# Altium project DDS.PrjPcb
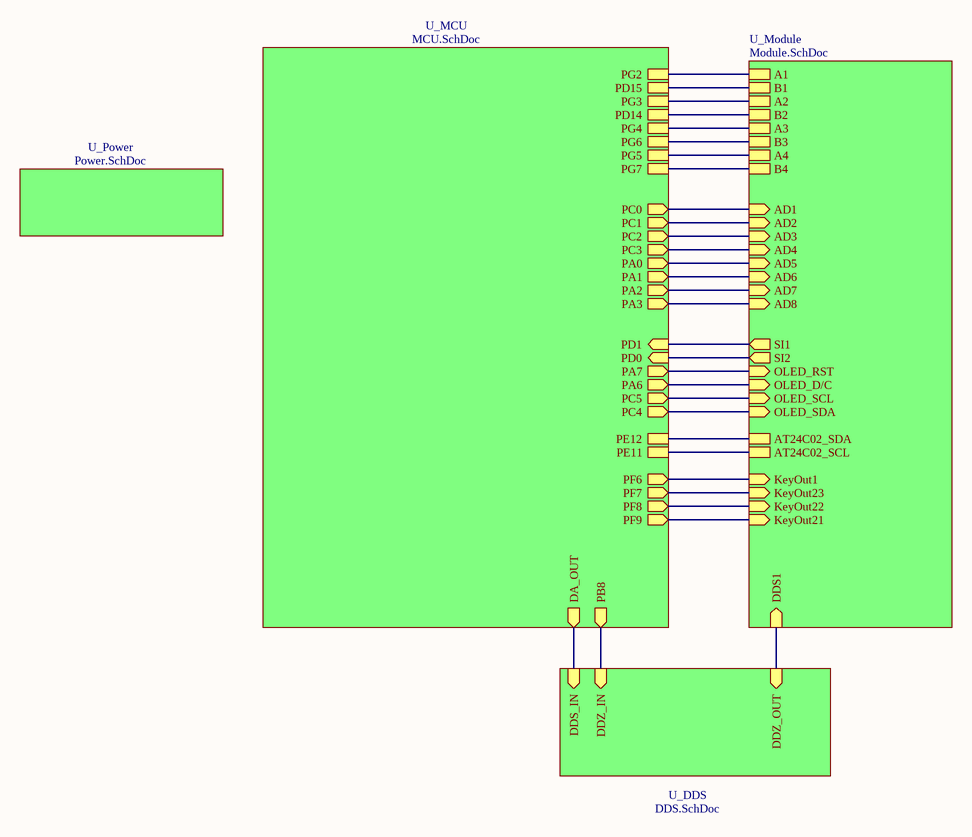
[diagram p0: TOP.SchDoc]
5 sheets, 127 parts. Net scope: hierarchical (ports join the sheet entries above them; power ports are global).
Board file: DDS.PcbDoc
Sheets:
  TOP.SchDoc
    U_Power = Power.SchDoc
    U_Module = Module.SchDoc
    U_MCU = MCU.SchDoc
    U_DDS = DDS.SchDoc

## Sheet TOP.SchDoc
size A4

### Sub-sheets
U_DDS = DDS.SchDoc: DDS_IN (in), DDZ_OUT (in), DDZ_IN (in)
U_MCU = MCU.SchDoc: PG3, PG4, PG2, PG5, PD15, PD14, PG6, PG7, PA2 (out), PA3 (out), PA7 (out), PA6 (out), PC4 (out), PC5 (out), PA0 (out), PA1 (out), PD1 (in), PB8 (out), DA_OUT (out), PC3 (out), PC2 (out), PC1 (out), PC0 (out), PE12, PE11, PD0 (in), PF6 (out), PF7 (out), PF8 (out), PF9 (out)
U_Module = Module.SchDoc: AT24C02_SCL, AT24C02_SDA, A1, B1, OLED_D/C (in), OLED_RST (in), OLED_SDA (in), OLED_SCL (in), DDS1 (in), A2, B2, A3, B3, A4, B4, SI1 (out), AD1 (in), AD2 (in), AD3 (in), AD4 (in), AD5 (in), AD6 (in), AD7 (in), AD8 (in), SI2 (out), KeyOut1 (in), KeyOut21 (in), KeyOut22 (in), KeyOut23 (in)
U_Power = Power.SchDoc: no entries

### Nets
A1: sheet U_Module/A1, sheet U_MCU/PG2
A2: sheet U_Module/A2, sheet U_MCU/PG3
A3: sheet U_Module/A3, sheet U_MCU/PG4
A4: sheet U_Module/A4, sheet U_MCU/PG5
B1: sheet U_Module/B1, sheet U_MCU/PD15
B2: sheet U_Module/B2, sheet U_MCU/PD14
B3: sheet U_Module/B3, sheet U_MCU/PG6
B4: sheet U_Module/B4, sheet U_MCU/PG7
NetC41_2: sheet U_Module/SI2, sheet U_MCU/PD0
NetC46_2: sheet U_Module/SI1, sheet U_MCU/PD1
NetJ1_20: sheet U_Module/DDS1, sheet U_DDS/DDZ_OUT
NetR8_2: sheet U_MCU/PB8, sheet U_DDS/DDZ_IN
NetR21_2: sheet U_Module/AT24C02_SCL, sheet U_MCU/PE11
NetR24_2: sheet U_Module/AT24C02_SDA, sheet U_MCU/PE12
NetR45_1: sheet U_MCU/DA_OUT, sheet U_DDS/DDS_IN
NetU3_18: sheet U_Module/KeyOut1, sheet U_MCU/PF6
NetU3_19: sheet U_Module/KeyOut23, sheet U_MCU/PF7
NetU3_20: sheet U_Module/KeyOut22, sheet U_MCU/PF8
NetU3_21: sheet U_Module/KeyOut21, sheet U_MCU/PF9
NetU3_26: sheet U_Module/AD1, sheet U_MCU/PC0
NetU3_27: sheet U_Module/AD2, sheet U_MCU/PC1
NetU3_28: sheet U_Module/AD3, sheet U_MCU/PC2
NetU3_29: sheet U_Module/AD4, sheet U_MCU/PC3
NetU3_34: sheet U_Module/AD5, sheet U_MCU/PA0
NetU3_35: sheet U_Module/AD6, sheet U_MCU/PA1
NetU3_36: sheet U_Module/AD7, sheet U_MCU/PA2
NetU3_37: sheet U_Module/AD8, sheet U_MCU/PA3
NetU3_42: sheet U_Module/OLED_D/C, sheet U_MCU/PA6
NetU3_43: sheet U_Module/OLED_RST, sheet U_MCU/PA7
NetU3_44: sheet U_Module/OLED_SDA, sheet U_MCU/PC4
NetU3_45: sheet U_Module/OLED_SCL, sheet U_MCU/PC5

## Sheet Power.SchDoc
size A4
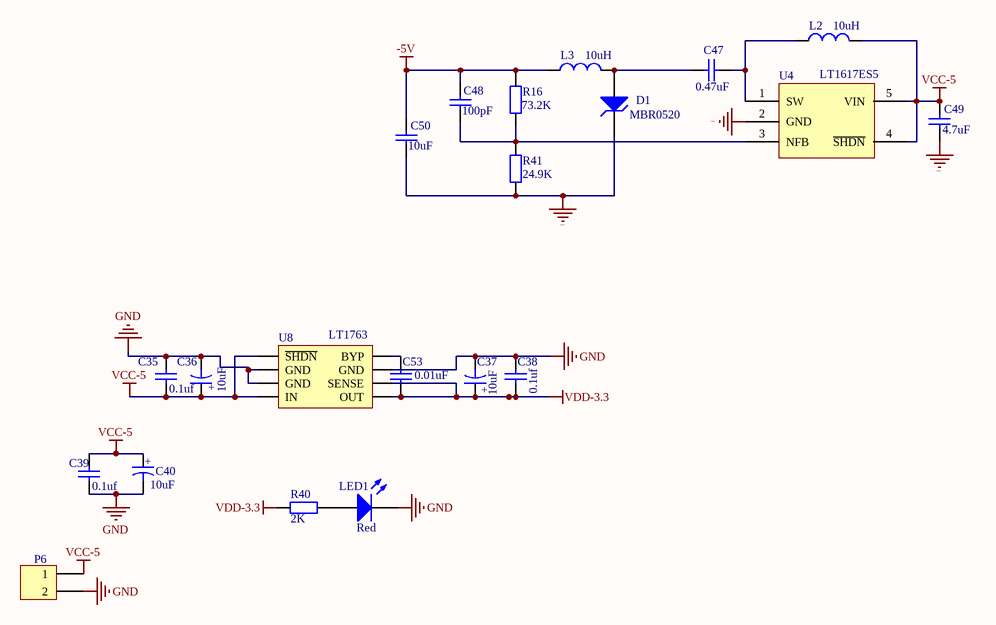
[diagram p1: Power.SchDoc]

### Parts
C35  value 0.1uf  [0805]  (hidden comment: Capacitor-0805)
C36  value 10uF  [钽电容1206（A3216）]  (hidden comment: 电解电容)
C37  value 10uF  [钽电容1206（A3216）]  (hidden comment: 电解电容)
C38  value 0.1uf  [0805]  (hidden comment: Capacitor-0805)
C39  value 0.1uf  [0805]  (hidden comment: Capacitor-0805)
C40  value 10uF  [钽电容1206（A3216）]  (hidden comment: 电解电容)
C47  value 0.47uF  [0805]  (hidden comment: Capacitor-0805)
C48  value 100pF  [0603]  (hidden comment: Capacitor-0603)
C49  value 4.7uF  [0805]  (hidden comment: Capacitor-0805)
C50  value 10uF  [0805]  (hidden comment: Capacitor-0805)
C53  value 0.01uF  [0603]  (hidden comment: Capacitor-0805)
D1  Name: MBR0520  [SMBJ20A]  (hidden comment: SMBJ20A)
L2  value 10uH  [0805]  (hidden comment: Inductor)
L3  value 10uH  [0805]  (hidden comment: Inductor)
LED1  Color: Red  [LED-0805]  (hidden comment: LED)
P6  端子  [2MM接线端子]  (value not drawn)
R16  value 73.2K  [0603]  (hidden comment: Resistor-0603)
R40  value 2K  [0603]  (hidden comment: Resistor-0603)
R41  value 24.9K  [0603]  (hidden comment: Resistor-0603)
U4  LT1617ES5  [SOT23-5]
U8  LT1763  [LT1963]

### Nets
-5V: C48.2 C50.2 L3.1 R16.2
GND: C35.2 C36.1 C37.1 C38.2 C39.1 C40.1 C49.1 C50.1 D1.2(K) LED1.2 P6.2 R41.1 U4.2(GND) U8.3(GND) U8.6(GND) U8.7(GND)
VCC-5: C35.1 C36.2 C39.2 C40.2 C49.2 L2.2 P6.1 U4.4(~{SHDN}) U4.5(VIN) U8.5(~{SHDN}) U8.8(IN)
VDD-3.3: C37.2 C38.1 C53.1 R40.2 U8.1(OUT) U8.2(SENSE)
NetC47_1: C47.1 L2.1 U4.1(SW)
NetC47_2: C47.2 D1.1(A) L3.2
NetC48_1: C48.1 R16.1 R41.2 U4.3(NFB)
NetC53_2: C53.2 U8.4(BYP)
NetLED1_1: LED1.1(A) R40.1

### Notes on the sheet
- (in symbol 电解电容) +
- (in symbol L) LT1963-3.3

### Library data of the parts
C35 C38 C39 C47 C49 C50 C53 = Capacitor
LED1 = LED: Value: LED
U4 = LT1617ES5: Value: LT1617ES5
U8 = LT1763: Value: LT1763

## Sheet Module.SchDoc
size A4
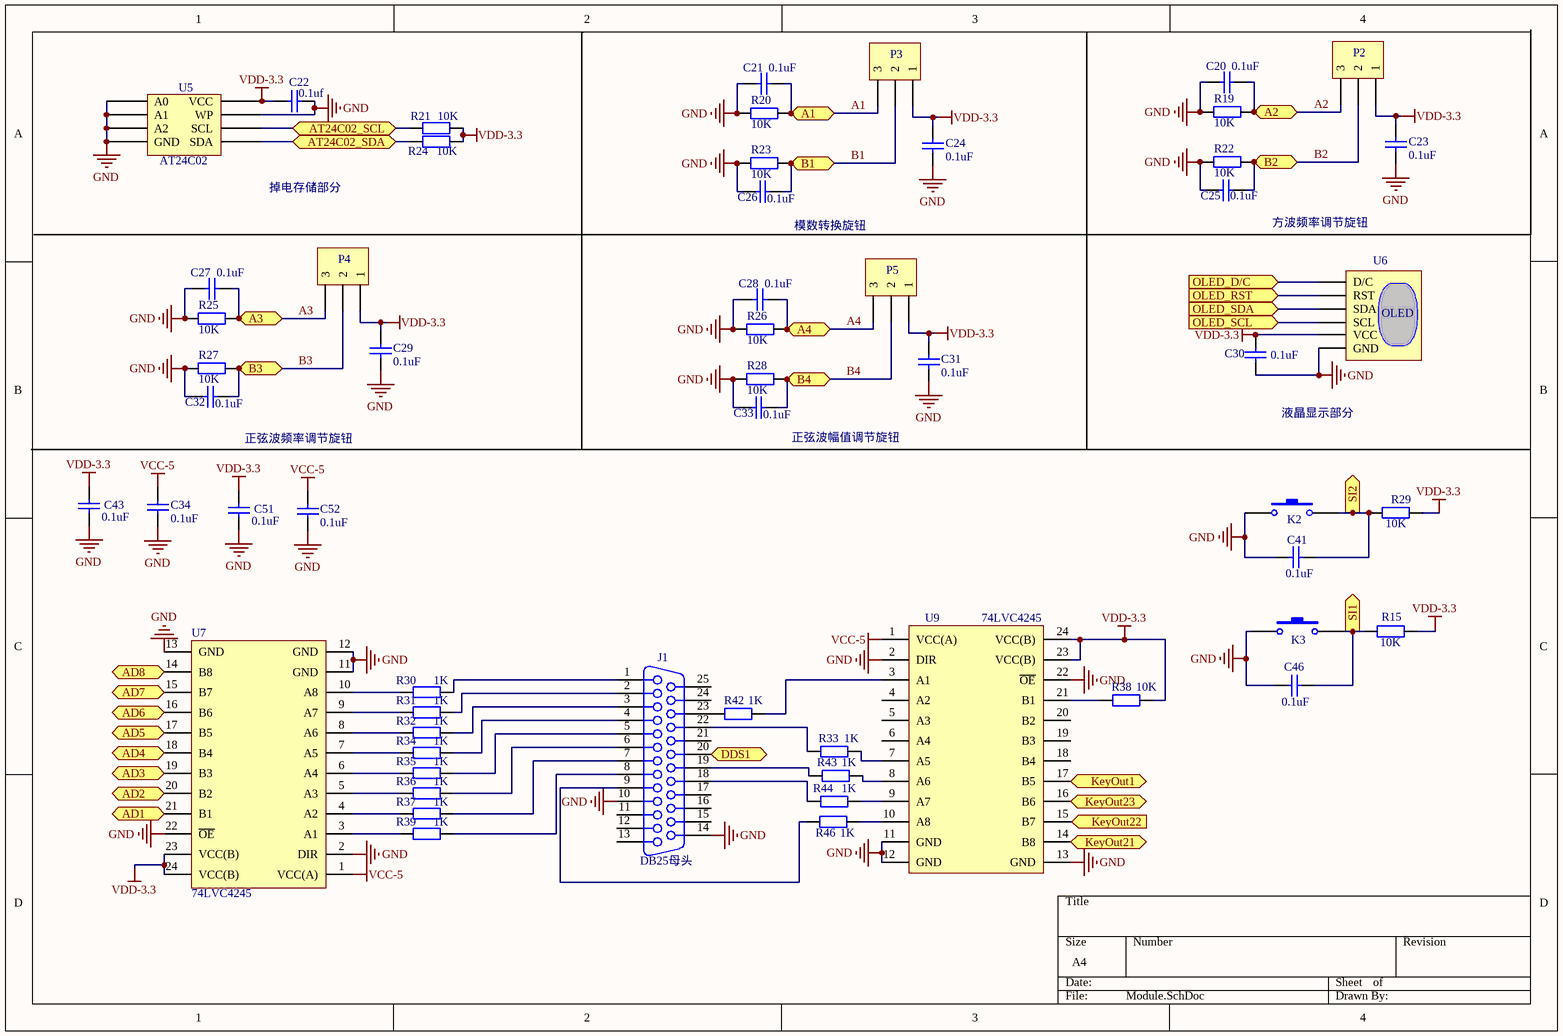
[diagram p2: Module.SchDoc]

### Parts
C20  value 0.1uF  [0603]  (hidden comment: Capacitor-0603)
C21  value 0.1uF  [0603]  (hidden comment: Capacitor-0603)
C22  value 0.1uf  [0603]  (hidden comment: Capacitor-0603)
C23  value 0.1uF  [0603]  (hidden comment: Capacitor-0603)
C24  value 0.1uF  [0603]  (hidden comment: Capacitor-0603)
C25  value 0.1uF  [0603]  (hidden comment: Capacitor-0603)
C26  value 0.1uF  [0603]  (hidden comment: Capacitor-0603)
C27  value 0.1uF  [0603]  (hidden comment: Capacitor-0603)
C28  value 0.1uF  [0603]  (hidden comment: Capacitor-0603)
C29  value 0.1uF  [0603]  (hidden comment: Capacitor-0603)
C30  value 0.1uF  [0603]  (hidden comment: Capacitor-0805)
C31  value 0.1uF  [0603]  (hidden comment: Capacitor-0603)
C32  value 0.1uF  [0603]  (hidden comment: Capacitor-0603)
C33  value 0.1uF  [0603]  (hidden comment: Capacitor-0603)
C34  value 0.1uF  [0603]  (hidden comment: Capacitor-0603)
C41  value 0.1uF  [0603]  (hidden comment: Capacitor-0603)
C43  value 0.1uF  [0603]  (hidden comment: Capacitor-0603)
C46  value 0.1uF  [0603]  (hidden comment: Capacitor-0603)
C51  value 0.1uF  [0603]  (hidden comment: Capacitor-0603)
C52  value 0.1uF  [0603]  (hidden comment: Capacitor-0603)
J1  value DB25母头  [DB25母头]  (hidden comment: DB25)
K2  按键  [2MM接线端子]  (value not drawn)
K3  按键  [2MM接线端子]  (value not drawn)
P2  端子3  [3MM接线端子]  (value not drawn)
P3  端子3  [3MM接线端子]  (value not drawn)
P4  端子3  [3MM接线端子]  (value not drawn)
P5  端子3  [3MM接线端子]  (value not drawn)
R15  value 10K  [0603]  (hidden comment: Resistor-0603)
R19  value 10K  [0603]  (hidden comment: Resistor-0603)
R20  value 10K  [0603]  (hidden comment: Resistor-0603)
R21  value 10K  [0603]  (hidden comment: Resistor-0603)
R22  value 10K  [0603]  (hidden comment: Resistor-0603)
R23  value 10K  [0603]  (hidden comment: Resistor-0603)
R24  value 10K  [0603]  (hidden comment: Resistor-0603)
R25  value 10K  [0603]  (hidden comment: Resistor-0603)
R26  value 10K  [0603]  (hidden comment: Resistor-0603)
R27  value 10K  [0603]  (hidden comment: Resistor-0603)
R28  value 10K  [0603]  (hidden comment: Resistor-0603)
R29  value 10K  [0603]  (hidden comment: Resistor-0603)
R30  value 1K  [0603]  (hidden comment: Resistor-0603)
R31  value 1K  [0603]  (hidden comment: Resistor-0603)
R32  value 1K  [0603]  (hidden comment: Resistor-0603)
R33  value 1K  [0603]  (hidden comment: Resistor-0603)
R34  value 1K  [0603]  (hidden comment: Resistor-0603)
R35  value 1K  [0603]  (hidden comment: Resistor-0603)
R36  value 1K  [0603]  (hidden comment: Resistor-0603)
R37  value 1K  [0603]  (hidden comment: Resistor-0603)
R38  value 10K  [0603]  (hidden comment: Resistor-0603)
R39  value 1K  [0603]  (hidden comment: Resistor-0603)
R42  value 1K  [0603]  (hidden comment: Resistor-0603)
R43  value 1K  [0603]  (hidden comment: Resistor-0603)
R44  value 1K  [0603]  (hidden comment: Resistor-0603)
R46  value 1K  [0603]  (hidden comment: Resistor-0603)
U5  AT24C02  [AT24C02]
U6  OLED  [OLED]
U7  74LVC4245  [74LVC4245-PW]
U9  74LVC4245  [74LVC4245-PW]

### Ports
A1, A2, A3, A4, AD1 (in), AD2 (in), AD3 (in), AD4 (in), AD5 (in), AD6 (in), AD7 (in), AD8 (in), AT24C02_SCL, AT24C02_SDA, B1, B2, B3, B4, DDS1 (in), KeyOut1 (in), KeyOut21 (in), KeyOut22 (in), KeyOut23 (in), OLED_D/C (in), OLED_RST (in), OLED_SCL (in), OLED_SDA (in), SI1 (out), SI2 (out)

### Nets
GND: C20.1 C21.1 C22.1 C23.2 C24.2 C25.1 C26.1 C27.1 C28.1 C29.2 C30.1 C31.2 C32.1 C33.1 C34.2 C41.1 C43.2 C46.1 C51.2 C52.2 J1.10 J1.14 K2.1 K3.1 R19.1 R20.1 R22.1 R23.1 R25.1 R26.1 R27.1 R28.1 U5.1(A0) U5.2(A1) U5.3(A2) U5.4(GND) U5.7(WP) U6.1(GND) U7.2(DIR) U7.11(GND) U7.12(GND) U7.13(GND) U7.22(~{OE}) U9.2(DIR) U9.11(GND) U9.12(GND) U9.13(GND) U9.22(~{OE})
VCC-5: C34.1 C52.1 U7.1(VCC(A)) U9.1(VCC(A))
VDD-3.3: C22.2 C23.1 C24.1 C29.1 C30.2 C31.1 C43.1 C51.1 P2.1 P3.1 P4.1 P5.1 R15.1 R21.1 R24.1 R29.2 R38.2 U5.8(VCC) U6.2(VCC) U7.23(VCC(B)) U7.24(VCC(B)) U9.23(VCC(B)) U9.24(VCC(B))
A1: C21.2 P3.3 R20.2 ; port A1
A2: C20.2 P2.3 R19.2 ; port A2
A3: C27.2 P4.3 R25.2 ; port A3
A4: C28.2 P5.3 R26.2 ; port A4
B1: C26.2 P3.2 R23.2 ; port B1
B2: C25.2 P2.2 R22.2 ; port B2
B3: C32.2 P4.2 R27.2 ; port B3
B4: C33.2 P5.2 R28.2 ; port B4
NetC41_2: C41.2 K2.2 R29.1 ; port SI2
NetC46_2: C46.2 K3.2 R15.2 ; port SI1
NetJ1_1: J1.1 R30.2
NetJ1_2: J1.2 R31.2
NetJ1_3: J1.3 R32.2
NetJ1_4: J1.4 R34.2
NetJ1_5: J1.5 R35.2
NetJ1_6: J1.6 R36.2
NetJ1_7: J1.7 R37.2
NetJ1_8: J1.8 R39.2
NetJ1_9: J1.9 R46.1
NetJ1_18: J1.18 R44.1
NetJ1_19: J1.19 R43.1
NetJ1_20: J1.20 ; port DDS1
NetJ1_22: J1.22 R33.1
NetJ1_23: J1.23 R42.1
NetR21_2: R21.2 U5.6(SCL) ; port AT24C02_SCL
NetR24_2: R24.2 U5.5(SDA) ; port AT24C02_SDA
NetR30_1: R30.1 U7.10(A8)
NetR31_1: R31.1 U7.9(A7)
NetR32_1: R32.1 U7.8(A6)
NetR33_2: R33.2 U9.7(A5)
NetR34_1: R34.1 U7.7(A5)
NetR35_1: R35.1 U7.6(A4)
NetR36_1: R36.1 U7.5(A3)
NetR37_1: R37.1 U7.4(A2)
NetR38_1: R38.1 U9.21(B1)
NetR39_1: R39.1 U7.3(A1)
NetR42_2: R42.2 U9.3(A1)
NetR43_2: R43.2 U9.8(A6)
NetR44_2: R44.2 U9.9(A7)
NetR46_2: R46.2 U9.10(A8)
NetU3_18: U9.17(B5) ; port KeyOut1
NetU3_19: U9.16(B6) ; port KeyOut23
NetU3_20: U9.15(B7) ; port KeyOut22
NetU3_21: U9.14(B8) ; port KeyOut21
NetU3_26: U7.21(B1) ; port AD1
NetU3_27: U7.20(B2) ; port AD2
NetU3_28: U7.19(B3) ; port AD3
NetU3_29: U7.18(B4) ; port AD4
NetU3_34: U7.17(B5) ; port AD5
NetU3_35: U7.16(B6) ; port AD6
NetU3_36: U7.15(B7) ; port AD7
NetU3_37: U7.14(B8) ; port AD8
NetU3_42: U6.6(D/C) ; port OLED_D/C
NetU3_43: U6.5(RST) ; port OLED_RST
NetU3_44: U6.4(SDA) ; port OLED_SDA
NetU3_45: U6.3(SCL) ; port OLED_SCL

Not connected (* = marked no-connect by the designer): J1 11 12 13 15 16 17 21 24 25; U9 4(A2) 5(A3) 6(A4) 18(B4) 19(B3) 20(B2)

### Notes on the sheet
- 掉电存储部分
- 模数转换旋钮
- 方波频率调节旋钮
- 正弦波频率调节旋钮
- 正弦波幅值调节旋钮
- 液晶显示部分

### Library data of the parts
C30 = Capacitor-0
U6 = O: Name: OLED
U5 = AT24C02: Name: AT24C02
U7 U9 = 74LVC4245: Name: 74LVC4245

## Sheet MCU.SchDoc
size A4
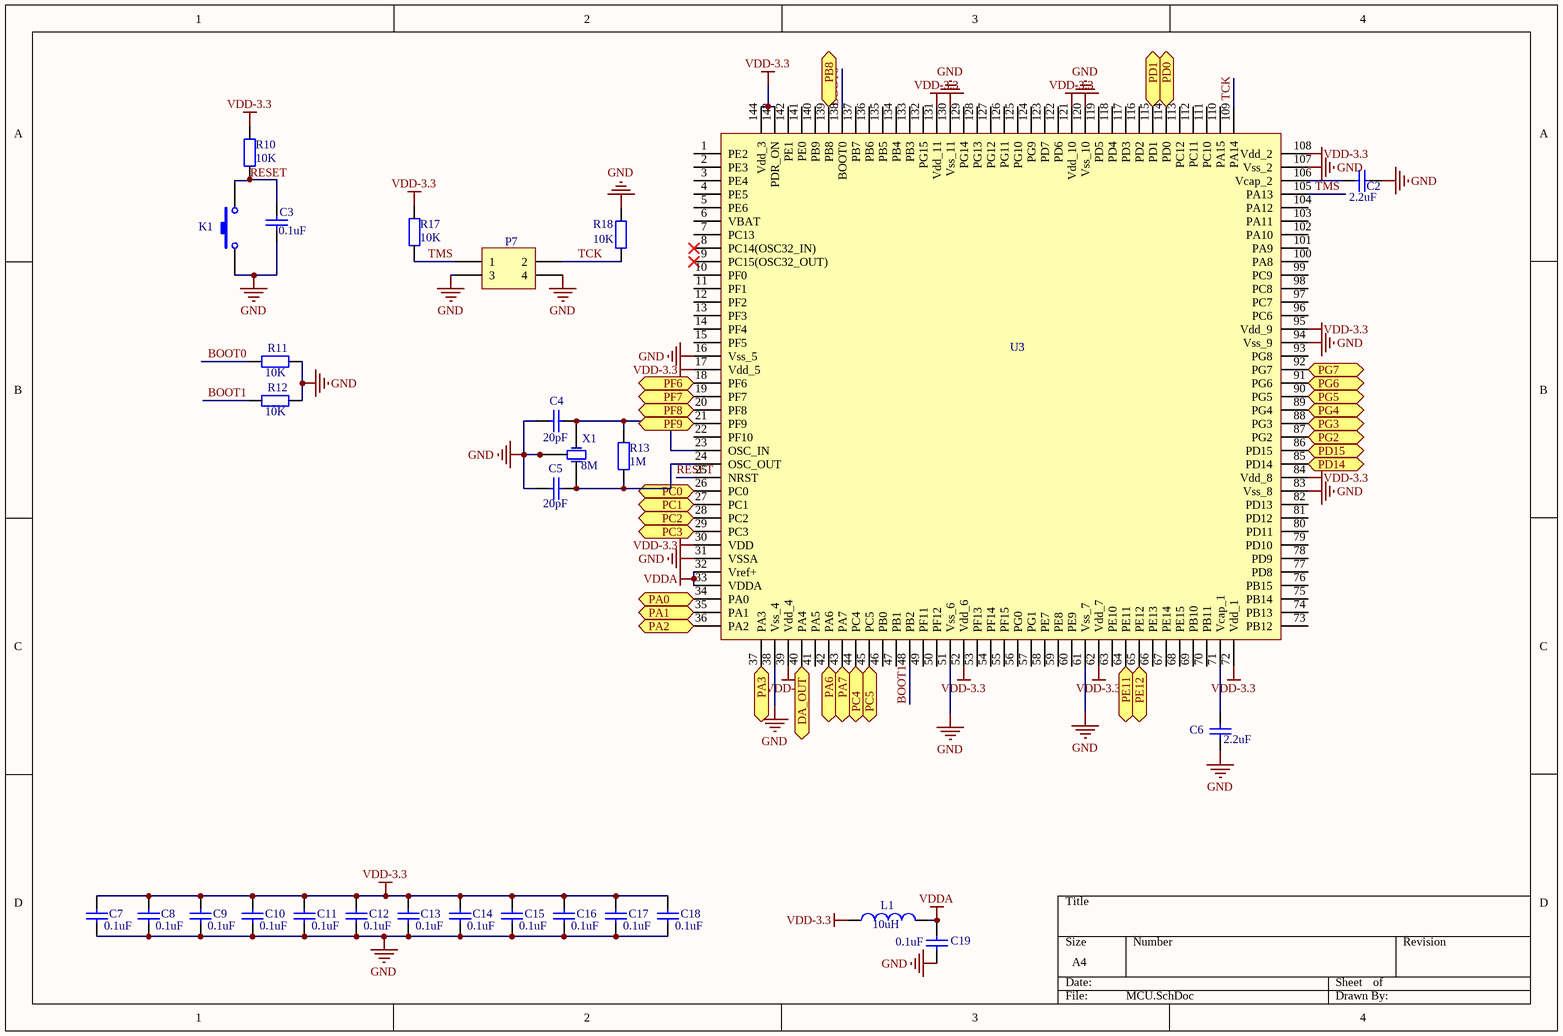
[diagram p3: MCU.SchDoc]

### Parts
C2  value 2.2uF  [0603]  (hidden comment: Capacitor-0603)
C3  value 0.1uF  [0603]  (hidden comment: Capacitor-0805)
C4  value 20pF  [0603]  (hidden comment: Capacitor-0603)
C5  value 20pF  [0603]  (hidden comment: Capacitor-0603)
C6  value 2.2uF  [0603]  (hidden comment: Capacitor-0603)
C7  value 0.1uF  [0603]  (hidden comment: Capacitor-0603)
C8  value 0.1uF  [0603]  (hidden comment: Capacitor-0603)
C9  value 0.1uF  [0603]  (hidden comment: Capacitor-0603)
C10  value 0.1uF  [0603]  (hidden comment: Capacitor-0603)
C11  value 0.1uF  [0603]  (hidden comment: Capacitor-0603)
C12  value 0.1uF  [0603]  (hidden comment: Capacitor-0603)
C13  value 0.1uF  [0603]  (hidden comment: Capacitor-0603)
C14  value 0.1uF  [0603]  (hidden comment: Capacitor-0603)
C15  value 0.1uF  [0603]  (hidden comment: Capacitor-0603)
C16  value 0.1uF  [0603]  (hidden comment: Capacitor-0603)
C17  value 0.1uF  [0603]  (hidden comment: Capacitor-0603)
C18  value 0.1uF  [0603]  (hidden comment: Capacitor-0603)
C19  value 0.1uF  [0603]  (hidden comment: Capacitor-0805)
K1  按键  [贴片按键]  (value not drawn)
L1  value 10uH  [0805]  (hidden comment: Inductor)
P7  Header 2X2  [HDR2X2]  (value not drawn)
R10  value 10K  [0603]  (hidden comment: Resistor-0805)
R11  value 10K  [0603]  (hidden comment: Resistor-0805)
R12  value 10K  [0603]  (hidden comment: Resistor-0805)
R13  value 1M  [0603]  (hidden comment: Resistor-0603)
R17  value 10K  [0603]  (hidden comment: Resistor-0805)
R18  value 10K  [0603]  (hidden comment: Resistor-0805)
U3  value STM32F407ZET6  [Stm32f407ZET6 - duplicate]  (hidden comment: STM32F407ZGT6)
X1  value 8M  [3225无源晶振]  (hidden comment: 3225无源晶振)

### Ports
DA_OUT (out), PA0 (out), PA1 (out), PA2 (out), PA3 (out), PA6 (out), PA7 (out), PB8 (out), PC0 (out), PC1 (out), PC2 (out), PC3 (out), PC4 (out), PC5 (out), PD0 (in), PD1 (in), PD14, PD15, PE11, PE12, PF6 (out), PF7 (out), PF8 (out), PF9 (out), PG2, PG3, PG4, PG5, PG6, PG7

### Nets
GND: C2.2 C3.1 C4.1 C5.1 C6.1 C7.1 C8.1 C9.1 C10.1 C11.1 C12.1 C13.1 C14.1 C15.1 C16.1 C17.1 C18.1 C19.1 K1.1 P7.3 P7.4 R11.1 R12.1 R18.2 U3.16(Vss_5) U3.31(VSSA) U3.38(Vss_4) U3.51(Vss_6) U3.61(Vss_7) U3.83(Vss_8) U3.94(Vss_9) U3.107(Vss_2) U3.120(Vss_10) U3.130(Vss_11) X1.2(GND) X1.4(GND)
VDD-3.3: C7.2 C8.2 C9.2 C10.2 C11.2 C12.2 C13.2 C14.2 C15.2 C16.2 C17.2 C18.2 L1.1 R10.2 R17.1 U3.17(Vdd_5) U3.30(VDD) U3.39(Vdd_4) U3.52(Vdd_6) U3.62(Vdd_7) U3.72(Vdd_1) U3.84(Vdd_8) U3.95(Vdd_9) U3.108(Vdd_2) U3.121(Vdd_10) U3.131(Vdd_11) U3.143(PDR_ON) U3.144(Vdd_3)
VDDA: C19.2 L1.2 U3.32(Vref+) U3.33(VDDA)
A1: U3.87(PG2) ; port PG2
A2: U3.88(PG3) ; port PG3
A3: U3.89(PG4) ; port PG4
A4: U3.90(PG5) ; port PG5
B1: U3.86(PD15) ; port PD15
B2: U3.85(PD14) ; port PD14
B3: U3.91(PG6) ; port PG6
B4: U3.92(PG7) ; port PG7
BOOT0: R11.2 U3.138(BOOT0)
BOOT1: R12.2 U3.48(PB2)
RESET: C3.2 K1.2 R10.1 U3.25(NRST)
TCK: P7.2 R18.1 U3.109(PA14)
TMS: P7.1 R17.2 U3.105(PA13)
NetC2_1: C2.1 U3.106(Vcap_2)
NetC4_2: C4.2 R13.2 U3.23(OSC_IN) X1.1(OSC1)
NetC5_2: C5.2 R13.1 U3.24(OSC_OUT) X1.3(OSC2)
NetC6_2: C6.2 U3.71(Vcap_1)
NetC41_2: U3.114(PD0) ; port PD0
NetC46_2: U3.115(PD1) ; port PD1
NetR8_2: U3.139(PB8) ; port PB8
NetR21_2: U3.64(PE11) ; port PE11
NetR24_2: U3.65(PE12) ; port PE12
NetR45_1: U3.40(PA4) ; port DA_OUT
NetU3_18: U3.18(PF6) ; port PF6
NetU3_19: U3.19(PF7) ; port PF7
NetU3_20: U3.20(PF8) ; port PF8
NetU3_21: U3.21(PF9) ; port PF9
NetU3_26: U3.26(PC0) ; port PC0
NetU3_27: U3.27(PC1) ; port PC1
NetU3_28: U3.28(PC2) ; port PC2
NetU3_29: U3.29(PC3) ; port PC3
NetU3_34: U3.34(PA0) ; port PA0
NetU3_35: U3.35(PA1) ; port PA1
NetU3_36: U3.36(PA2) ; port PA2
NetU3_37: U3.37(PA3) ; port PA3
NetU3_42: U3.42(PA6) ; port PA6
NetU3_43: U3.43(PA7) ; port PA7
NetU3_44: U3.44(PC4) ; port PC4
NetU3_45: U3.45(PC5) ; port PC5

Not connected (* = marked no-connect by the designer): U3 1(PE2) 2(PE3) 3(PE4) 4(PE5) 5(PE6) 6(VBAT) 7(PC13) 8(PC14(OSC32_IN))* 9(PC15(OSC32_OUT))* 10(PF0) 11(PF1) 12(PF2) 13(PF3) 14(PF4) 15(PF5) 22(PF10) 41(PA5) 46(PB0) 47(PB1) 49(PF11) 50(PF12) 53(PF13) 54(PF14) 55(PF15) 56(PG0) 57(PG1) 58(PE7) 59(PE8) 60(PE9) 63(PE10) 66(PE13) 67(PE14) 68(PE15) 69(PB10) 70(PB11) 73(PB12) 74(PB13) 75(PB14) 76(PB15) 77(PD8) 78(PD9) 79(PD10) 80(PD11) 81(PD12) 82(PD13) 93(PG8) 96(PC6) 97(PC7) 98(PC8) 99(PC9) 100(PA8) 101(PA9) 102(PA10) 103(PA11) 104(PA12) 110(PA15) 111(PC10) 112(PC11) 113(PC12) 116(PD2) 117(PD3) 118(PD4) 119(PD5) 122(PD6) 123(PD7) 124(PG9) 125(PG10) 126(PG11) 127(PG12) 128(PG13) 129(PG14) 132(PG15) 133(PB3) 134(PB4) 135(PB5) 136(PB6) 137(PB7) 140(PB9) 141(PE0) 142(PE1)

### Library data of the parts
C3 = Capacitor-0
C19 = Capacitor
L1 = Ind
P7 = Header 2X2: Header, 2-Pin, Dual row; LatestRevisionDate: 17-Jul-2002; LatestRevisionNote: Re-released for DXP Platform.; Publisher: Altium Limited
R10-R12 R17 R18 = Resistor-0
U3 = STM32F407ZET6

## Sheet DDS.SchDoc
size A4
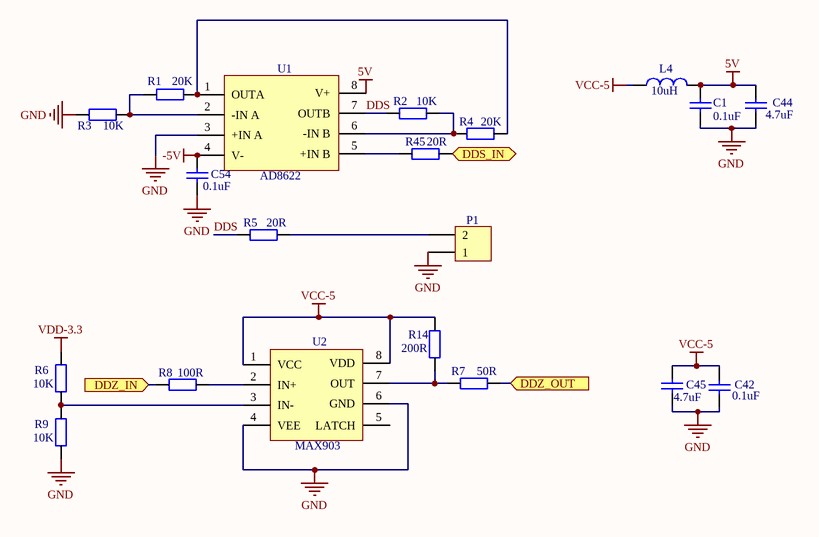
[diagram p4: DDS.SchDoc]

### Parts
C1  value 0.1uF  [0603]  (hidden comment: Capacitor-0603)
C42  value 0.1uF  [0603]  (hidden comment: Capacitor-0603)
C44  value 4.7uF  [0603]  (hidden comment: Capacitor-0603)
C45  value 4.7uF  [0603]  (hidden comment: Capacitor-0603)
C54  value 0.1uF  [0603]  (hidden comment: Capacitor-0603)
L4  value 10uH  [0805]  (hidden comment: Inductor)
P1  端子  [2MM接线端子]  (value not drawn)
R1  value 20K  [0603]  (hidden comment: Resistor-0603)
R2  value 10K  [0603]  (hidden comment: Resistor-0603)
R3  value 10K  [0603]  (hidden comment: Resistor-0603)
R4  value 20K  [0603]  (hidden comment: Resistor-0603)
R5  value 20R  [0603]  (hidden comment: Resistor-0603)
R6  value 10K  [0603]  (hidden comment: Resistor-0805)
R7  value 50R  [0603]  (hidden comment: Resistor-0603)
R8  value 100R  [0603]  (hidden comment: Resistor-0603)
R9  value 10K  [0603]  (hidden comment: Resistor-0805)
R14  value 200R  [0603]  (hidden comment: Resistor-0603)
R45  value 20R  [0603]  (hidden comment: Resistor-0603)
U1  AD8622  [LM358-D]
U2  MAX903  [LM358-D]

### Ports
DDS_IN (in), DDZ_IN (in), DDZ_OUT (in)

### Nets
5V: C1.1 C44.1 L4.2 U1.8(V+)
-5V: C54.1 U1.4(V-)
GND: C1.2 C42.2 C44.2 C45.2 C54.2 P1.1 R3.2 R9.1 U1.3(+IN_A) U2.4(VEE) U2.6(GND)
VCC-5: C42.1 C45.1 L4.1 R14.1 U2.1(VCC) U2.8(VDD)
VDD-3.3: R6.2
DDS: R2.2 R5.2 U1.7(OUTB)
NetJ1_20: R7.1 ; port DDZ_OUT
NetP1_2: P1.2 R5.1
NetR1_1: R1.1 R4.1 U1.1(OUTA)
NetR1_2: R1.2 R3.1 U1.2(-IN_A)
NetR2_1: R2.1 R4.2 U1.6(-IN_B)
NetR6_1: R6.1 R9.2 U2.3(IN-)
NetR7_2: R7.2 R14.2 U2.7(OUT)
NetR8_1: R8.1 U2.2(IN+)
NetR8_2: R8.2 ; port DDZ_IN
NetR45_1: R45.1 ; port DDS_IN
NetR45_2: R45.2 U1.5(+IN_B)

Not connected (* = marked no-connect by the designer): U2 5(LATCH)

### Library data of the parts
R6 R9 = Resistor-0
U1 = AD8622: Name: AD8622
U2 = MAX903: Name: MAX903

## Nets that join several sheets
-5V: Power (C48.2 C50.2 L3.1 R16.2), DDS (C54.1 U1.4)
GND: Power (16 pins), Module (48 pins), MCU (36 pins), DDS (11 pins)
VCC-5: Power (11 pins), Module (C34.1 C52.1 U7.1 U9.1), DDS (6 pins)
VDD-3.3: Power (6 pins), Module (23 pins), MCU (28 pins), DDS (R6.2)
A1: Module (C21.2 P3.3 R20.2), MCU (U3.87)
A2: Module (C20.2 P2.3 R19.2), MCU (U3.88)
A3: Module (C27.2 P4.3 R25.2), MCU (U3.89)
A4: Module (C28.2 P5.3 R26.2), MCU (U3.90)
B1: Module (C26.2 P3.2 R23.2), MCU (U3.86)
B2: Module (C25.2 P2.2 R22.2), MCU (U3.85)
B3: Module (C32.2 P4.2 R27.2), MCU (U3.91)
B4: Module (C33.2 P5.2 R28.2), MCU (U3.92)
NetC41_2: Module (C41.2 K2.2 R29.1), MCU (U3.114)
NetC46_2: Module (C46.2 K3.2 R15.2), MCU (U3.115)
NetJ1_20: Module (J1.20), DDS (R7.1)
NetR8_2: MCU (U3.139), DDS (R8.2)
NetR21_2: Module (R21.2 U5.6), MCU (U3.64)
NetR24_2: Module (R24.2 U5.5), MCU (U3.65)
NetR45_1: MCU (U3.40), DDS (R45.1)
NetU3_18: Module (U9.17), MCU (U3.18)
NetU3_19: Module (U9.16), MCU (U3.19)
NetU3_20: Module (U9.15), MCU (U3.20)
NetU3_21: Module (U9.14), MCU (U3.21)
NetU3_26: Module (U7.21), MCU (U3.26)
NetU3_27: Module (U7.20), MCU (U3.27)
NetU3_28: Module (U7.19), MCU (U3.28)
NetU3_29: Module (U7.18), MCU (U3.29)
NetU3_34: Module (U7.17), MCU (U3.34)
NetU3_35: Module (U7.16), MCU (U3.35)
NetU3_36: Module (U7.15), MCU (U3.36)
NetU3_37: Module (U7.14), MCU (U3.37)
NetU3_42: Module (U6.6), MCU (U3.42)
NetU3_43: Module (U6.5), MCU (U3.43)
NetU3_44: Module (U6.4), MCU (U3.44)
NetU3_45: Module (U6.3), MCU (U3.45)